# EAGLE design Knob (EAGLE 7.1.0)
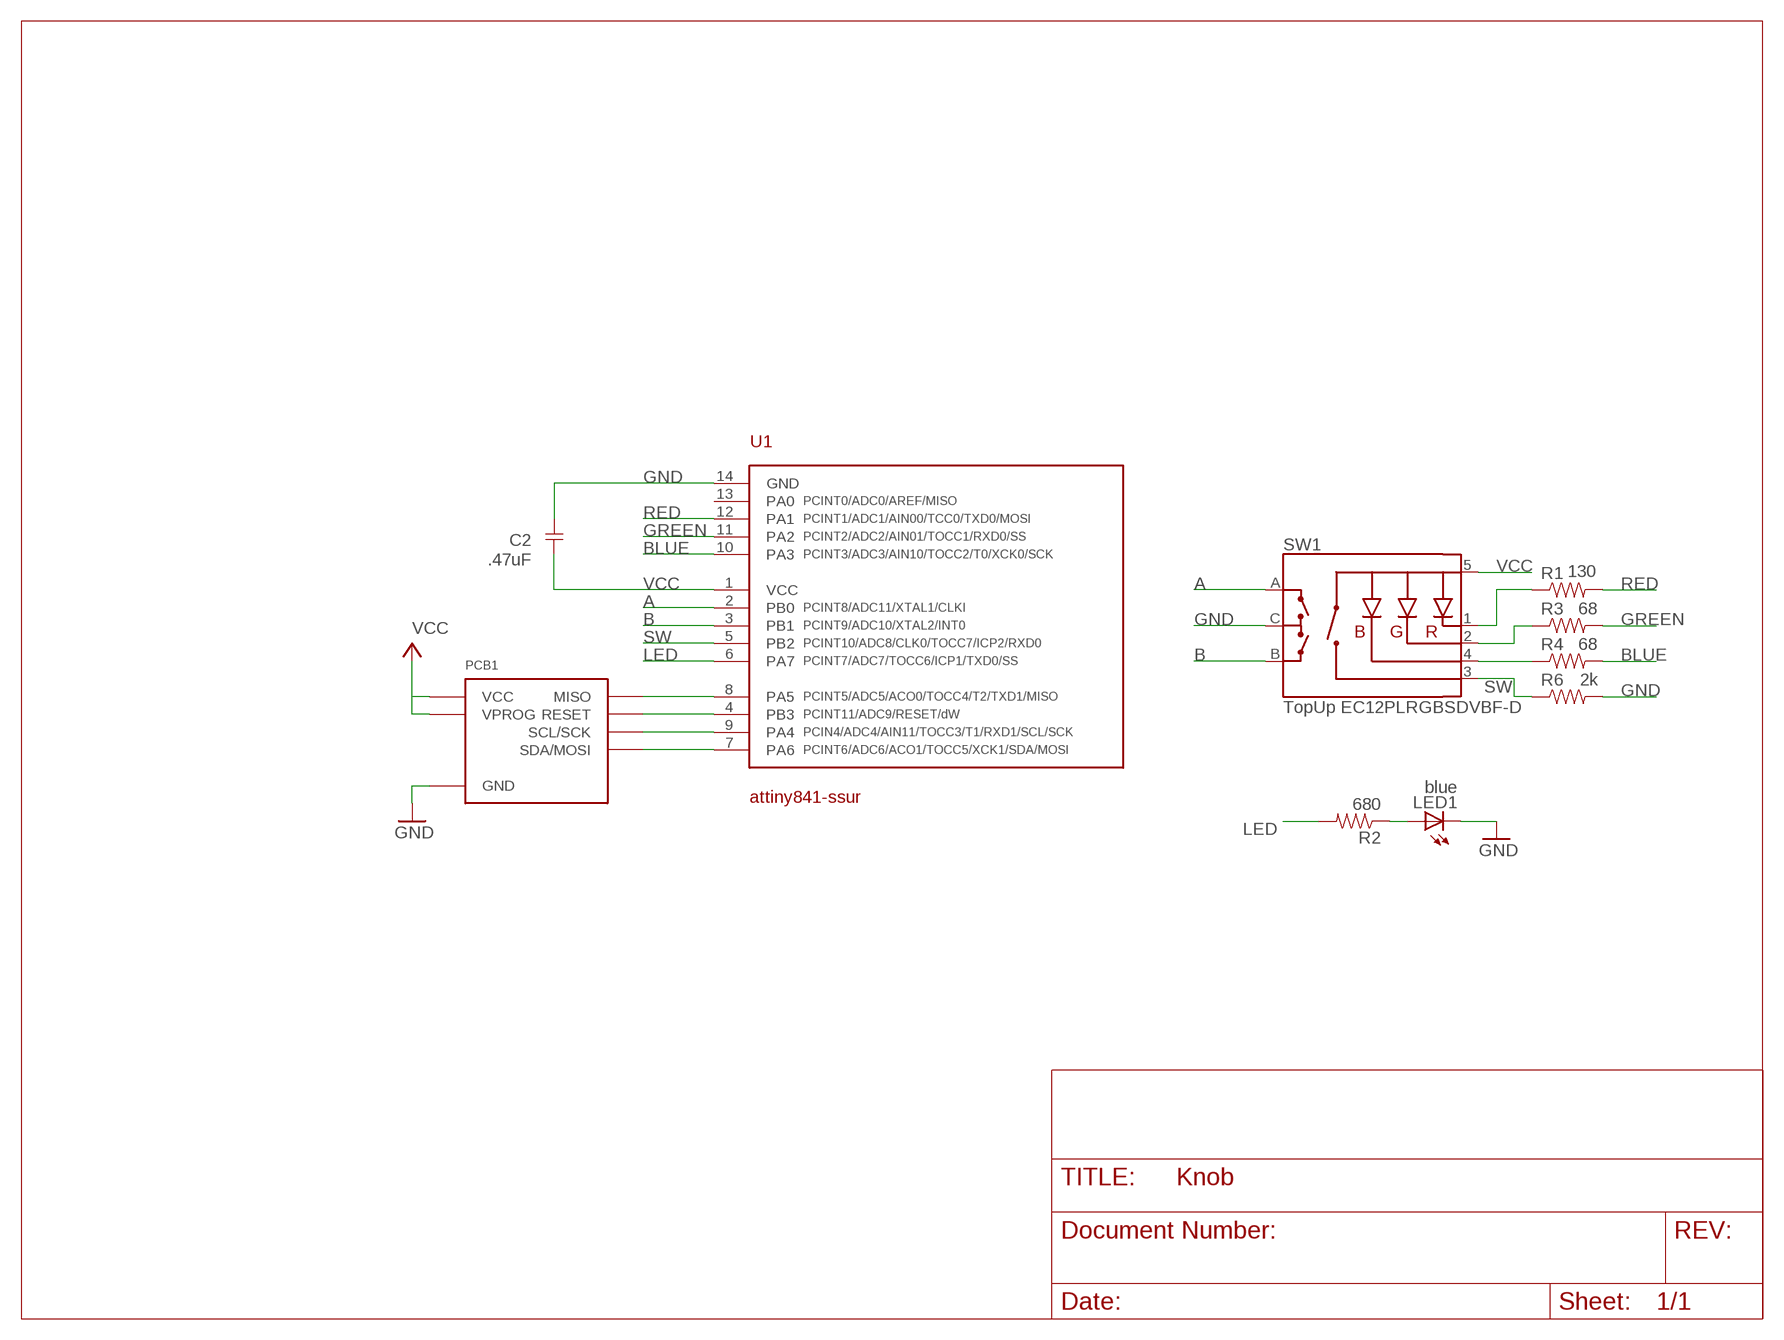
[diagram p0: schematic, sheet 1]

## Parts
C2  .47uF  CAPACITOR  [0805]
LED1  blue  LED-0805-BLUE  [0805-LED]
PCB1  MAGDEVICE-V2  [MAGDEVICE-V2]
R1  130  RESISTOR  [0805]
R2  680  RESISTOR  [0805]
R3  68  RESISTOR  [0805]
R4  68  RESISTOR  [0805]
R6  2k  RESISTOR  [0805]
SW1  TopUp EC12PLRGBSDVBF-D  ENCODER_RGB_CA  [ENCODER_LED_3]
U1  attiny841-ssur  ATTINY841  [SOIC14]

## Nets
A: SW1.A U1.2(PB0)
B: SW1.B U1.3(PB1)
BLUE: R4.2 U1.10(PA3)
GND: C2.2 LED1.C PCB1.GND R6.2 SW1.C U1.14(GND)
GREEN: R3.2 U1.11(PA2)
LED: R2.2 U1.6(PA7)
MISO: PCB1.MISO U1.8(PA5)
N$4: R1.1 SW1.1(-R)
N$5: R3.1 SW1.2(-G)
N$6: R4.1 SW1.4(-B)
N$7: LED1.A R2.1
RED: R1.2 U1.12(PA1)
RESET: PCB1.RESET U1.4(PB3)
SCL/SCK: PCB1.SCL(SCL/SCK) U1.9(PA4)
SDA/MOSI: PCB1.SDA(SDA/MOSI) U1.7(PA6)
SW: R6.1 SW1.3(SW) U1.5(PB2)
VCC: C2.1 PCB1.VCC PCB1.VPROG SW1.5(+) U1.1(VCC)
Unconnected: U1.13(PA0)

## Library data of the parts
C2 = Modulo:CAPACITOR: Capacitor
LED1 = Modulo:LED: LED; PARTNUM: LTST-C171TBKT
PCB1 = Modulo:MAGDEVICE
R1-R4 R6 = Modulo:RESISTOR: Resistor Basic schematic elements and footprints for 0603, 1206, and PTH resistors.
SW1 = Modulo:ENCODER_RGB_CA: Illuminated Rotary Encoder w/ RGB LED and select switch EC12PLRGBSDVBF-D: http://top-up.so-buy.com/front/bin/ptdetail.phtml?Part=EC12PLRGBSDVBF-D
U1 = IntegerLabs:ATTINY841

## Board
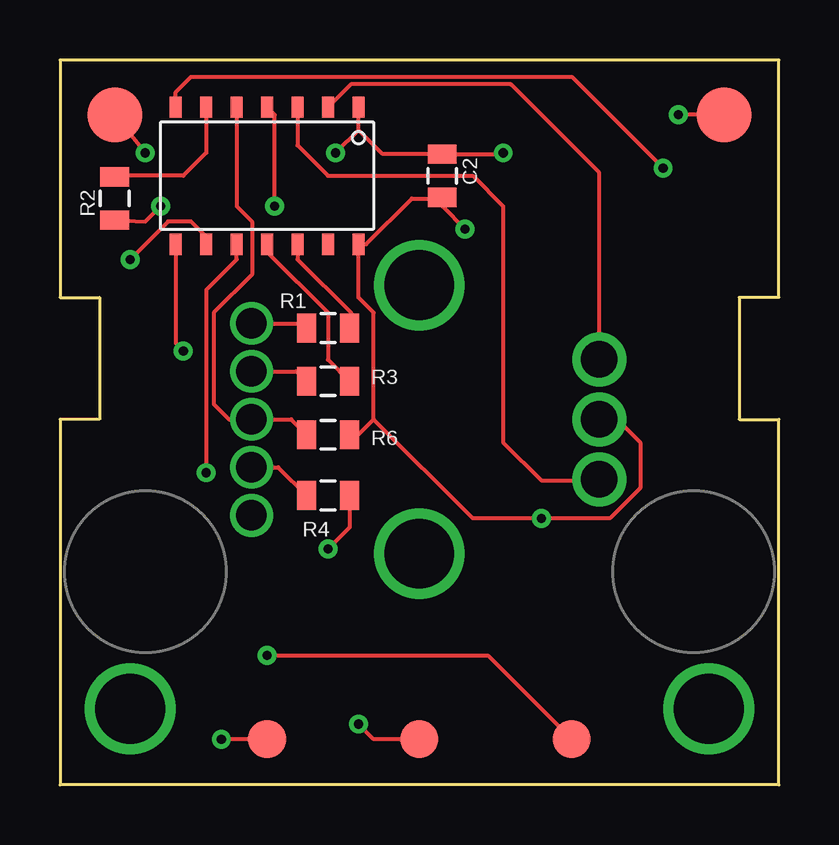
[diagram p1: board, top side]
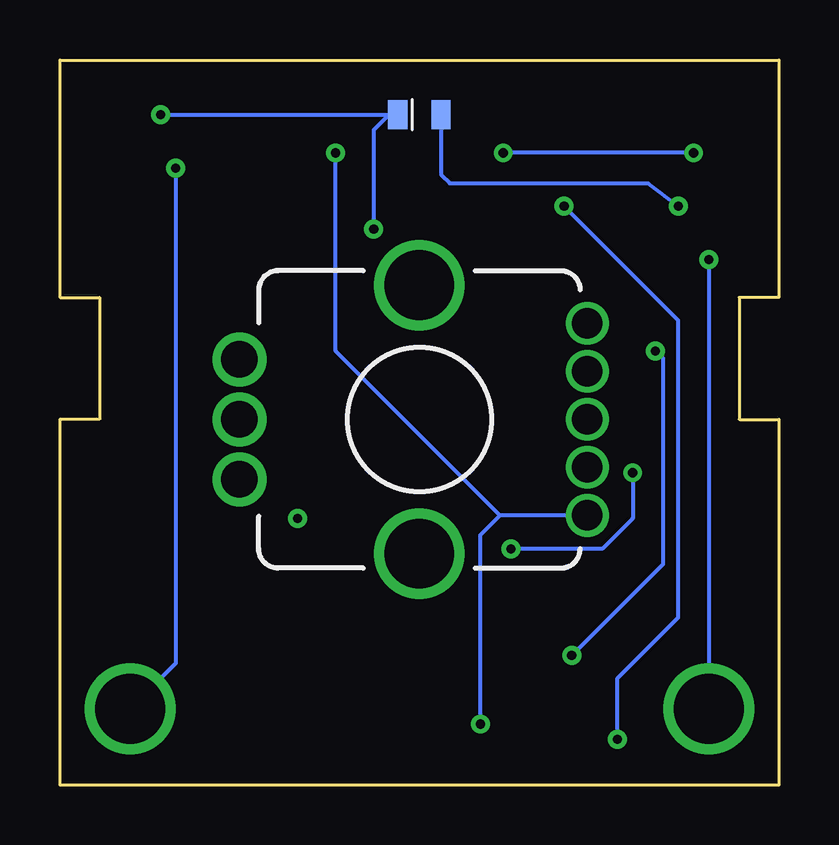
[diagram p2: board, bottom side, seen from below]

Size 29.97 x 30.23 mm. Coordinates in mm from the lower left corner, seen from the top.
Copper layers (1*16): Top 0.0178mm / dielectric 59mil / Bottom 0.0178mm
Design rules "SSC-EAGLE-2Lyr_v1.0.0.3 *": minimum track width 6mil, minimum drill 14mil, track to track 6mil, track to pad 6mil, pad to pad 6mil, via to via 6mil, smd to smd 6mil, copper to edge 20mil, drill to drill 16mil, minimum pad ring 8mil, minimum via ring 8mil, stop-mask expansion 3mil, vias tented up to drill 25mil, thermal gap 10mil

### Footprints (pad centres in the part's own frame; a part is rotated, then mirrored left to right if it is on the bottom)
0805 = smd 0.8 x 1.2: 1 -0.9,0; 2 0.9,0
0805-LED = smd 1.2 x 0.8: A 0,-0.9; C 0,0.9
MAGDEVICE-V2 = smd 2.286 x 2.286 bottom: GND 2.54,27.94; VCC 27.94,27.94 | smd 1.587 x 1.587 bottom: MISO 8.89,1.905; RESET 21.59,1.905; VPROG 15.24,1.905 | drill 2.921: SCL 27.305,3.175; SDA 3.175,3.175
ENCODER_LED_3 = drill 1.27 pad 1.778: 1 -4,7; 2 -2,7; 3 0,7; 4 2,7; 5 4,7 | drill 1.524 pad 2.25: A -2.5,-7.5; B 2.5,-7.5; C 0,-7.5 | drill 2.9: M1 -5.6,0; M2 5.6,0
SOIC14 = smd 0.508 x 0.889: 1 0,-3.175; 2 1.27,-3.175; 3 2.54,-3.175; 4 3.81,-3.175; 5 5.08,-3.175; 6 6.35,-3.175; 7 7.62,-3.175; 8 7.62,2.54; 9 6.35,2.54; 10 5.08,2.54; 11 3.81,2.54; 12 2.54,2.54; 13 1.27,2.54; 14 0,2.54

### Placement (x,y rotation side)
C2  15.94,25.4 270 top
LED1  14.99,27.94 90 bottom
PCB1  30.23,0 0 bottom
R1  11.18,19.05 0 top
R2  2.29,24.45 90 top
R3  11.18,16.83 0 top
R4  11.18,12.06 0 top
R6  11.18,14.61 0 top
SW1  14.99,15.24 270 bottom
U1  12.45,25.08 180 top

### Tracks (layer width: path | path; a pad name or v marks a point on that pad's centre or on a via)
A
  Top 0.159: SW1.A 22.49,25.52 18.8,29.21 12.13,29.21 U1.2
B
  Top 0.159: U1.3 9.91,26.67 11.18,25.4 17.21,25.4 18.48,24.13 18.48,14.29 20.07,12.7 22.45,12.7 SW1.B
BLUE  (via drill 0.38)
  Top 0.159: R4.2 12.08,10.74 v11.18,9.84 | U1.10 7.37,21.91 6.1,20.64 v6.1,13.02
  Bottom 0.159: v6.1,13.02 6.1,11.11 7.37,9.84 v11.18,9.84
GND  (via drill 0.38)
  Top 0.159: v16.89,23.18 15.94,24.13 C2.2 15.89,24.45 14.67,24.45 12.76,22.54 U1.14 12.45,20.32 13.08,19.68 13.08,15.24 | R6.2 12.45,14.61 13.08,15.24 | SW1.C 23.24,15.24 24.19,14.29 24.19,12.38 22.92,11.11 v20.07,11.11 17.21,11.11 13.08,15.24 | PCB1.GND v25.78,27.94
  Bottom 0.159: v16.89,23.18 16.89,27.3 16.26,27.94 LED1.C v25.78,27.94
GREEN
  Top 0.159: U1.11 8.64,22.23 11.18,19.68 11.18,17.73 R3.2
LED
  Top 0.159: U1.6 6.1,26.35 5.14,25.4 2.34,25.4 R2.2
MISO  (via drill 0.38)
  Top 0.159: v8.64,5.4 17.84,5.4 PCB1.MISO | U1.8 4.83,18.41 v5.14,18.1
  Bottom 0.159: v8.64,5.4 4.83,9.21 4.83,17.78 v5.14,18.1
N$4
  Top 0.159: SW1.1 10.09,19.24 R1.1
N$5
  Top 0.159: SW1.2 9.86,17.24 R3.1
N$6
  Top 0.159: SW1.4 9.1,13.24 R4.1
N$7  (via drill 0.38)
  Top 0.159: R2.1 3.56,23.5 v4.19,24.13
  Bottom 0.159: LED1.A 14.09,25.45 13.72,25.08 5.46,25.08 v4.19,24.13
RED
  Top 0.159: U1.12 9.91,21.91 12.13,19.68 12.13,19.1 R1.2
RESET  (via drill 0.38)
  Top 0.159: PCB1.RESET v6.73,1.91 | v8.95,24.13 8.95,27.94 U1.4
  Bottom 0.159: v6.73,1.91 6.73,4.45 4.19,6.99 4.19,19.37 v8.95,24.13
SCL/SCK  (via drill 0.38)
  Top 0.159: U1.9 6.1,22.86 5.46,23.5 4.51,23.5 v2.92,21.91
  Bottom 0.159: v2.92,21.91 PCB1.SCL
SDA/MOSI  (via drill 0.38)
  Top 0.159: U1.7 4.83,28.89 5.46,29.53 21.34,29.53 v25.15,25.72
  Bottom 0.159: v25.15,25.72 25.15,5.08 PCB1.SDA
SW
  Top 0.159: R6.1 9.64,15.24 SW1.3 7.05,15.24 6.41,15.88 6.41,19.68 8,21.27 8,23.5 7.37,24.13 U1.5
VCC  (via drill 0.38)
  Top 0.159: 12.45,27.3 13.45,26.3 C2.1 18.43,26.3 v18.48,26.35 | 12.45,27.3 U1.1 | PCB1.VCC v3.56,26.35 | 12.45,27.3 v11.49,26.35 | PCB1.VPROG 13.08,1.91 v12.45,2.54
  Bottom 0.159: v3.56,26.35 v11.49,26.35 | SW1.5 11.62,11.24 | 11.62,11.24 18.48,18.1 v18.48,26.35 | v12.45,2.54 12.45,10.41 11.62,11.24